# EAGLE schematic stencil8 (EAGLE 5.12)
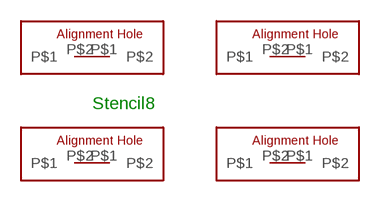
[diagram p0: schematic, sheet 1]

## Parts
U$1  ALIGNMENT-HOLE  [ALIGNMENT-HOLE-3MM]
U$2  ALIGNMENT-HOLE  [ALIGNMENT-HOLE-3MM]
U$3  ALIGNMENT-HOLE  [ALIGNMENT-HOLE-3MM]
U$4  ALIGNMENT-HOLE  [ALIGNMENT-HOLE-3MM]
Unconnected: U$1.P$1 U$1.P$2 U$2.P$1 U$2.P$2 U$3.P$1 U$3.P$2 U$4.P$1 U$4.P$2

## Notes on the sheet
- Stencil8

## Library data of the parts
U$1-U$4 = Hoektronics:ALIGNMENT-HOLE